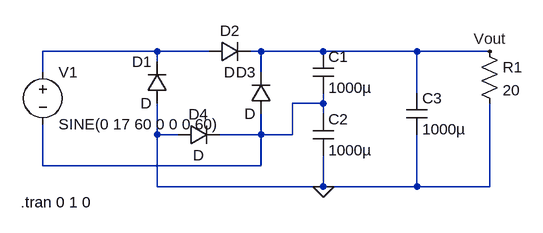
[diagram p0: schematic SMPS.asc]
SMPS.asc, the LTspice schematic file:
Version 4
SHEET 1 880 680
WIRE 112 112 -64 112
WIRE 192 112 112 112
WIRE 272 112 256 112
WIRE 368 112 272 112
WIRE 512 112 368 112
WIRE 624 112 512 112
WIRE 112 128 112 112
WIRE -64 144 -64 112
WIRE 272 144 272 112
WIRE 512 176 512 112
WIRE 368 192 368 176
WIRE 368 192 320 192
WIRE 368 208 368 192
WIRE 112 240 112 192
WIRE 144 240 112 240
WIRE 272 240 272 208
WIRE 272 240 208 240
WIRE 320 240 320 192
WIRE 320 240 272 240
WIRE -64 288 -64 224
WIRE 272 288 272 240
WIRE 272 288 -64 288
WIRE 112 320 112 240
WIRE 368 320 368 272
WIRE 368 320 112 320
WIRE 512 320 512 240
WIRE 512 320 368 320
WIRE 624 320 624 192
WIRE 624 320 512 320
FLAG 368 320 0
FLAG 624 112 Vout
SYMBOL diode 128 192 R180
WINDOW 0 24 64 Left 2
WINDOW 3 24 0 Left 2
SYMATTR InstName D1
SYMBOL diode 192 128 R270
WINDOW 0 32 32 VTop 2
WINDOW 3 0 32 VBottom 2
SYMATTR InstName D2
SYMBOL diode 288 208 R180
WINDOW 0 24 64 Left 2
WINDOW 3 24 0 Left 2
SYMATTR InstName D3
SYMBOL diode 144 256 R270
WINDOW 0 32 32 VTop 2
WINDOW 3 0 32 VBottom 2
SYMATTR InstName D4
SYMBOL cap 352 112 R0
SYMATTR InstName C1
SYMATTR Value 1000µ
SYMBOL voltage -64 128 R0
WINDOW 123 0 0 Left 2
WINDOW 39 0 0 Left 2
SYMATTR InstName V1
SYMATTR Value SINE(0 17 60 0 0 0 60)
SYMBOL res 608 96 R0
SYMATTR InstName R1
SYMATTR Value 20
SYMBOL cap 352 208 R0
SYMATTR InstName C2
SYMATTR Value 1000µ
SYMBOL cap 496 176 R0
SYMATTR InstName C3
SYMATTR Value 1000µ
TEXT -98 344 Left 2 !.tran 0 1 0

The netlist it stands for:
* SMPS.asc
D1 0 N001 D
D2 N001 Vout D
D3 N002 Vout D
D4 0 N002 D
C1 Vout N002 1000µ
V1 N001 N002 SINE(0 17 60 0 0 0 60)
R1 Vout 0 20
C2 N002 0 1000µ
C3 Vout 0 1000µ
.model D D
.lib standard.dio
.tran 0 1 0
.backanno
.end